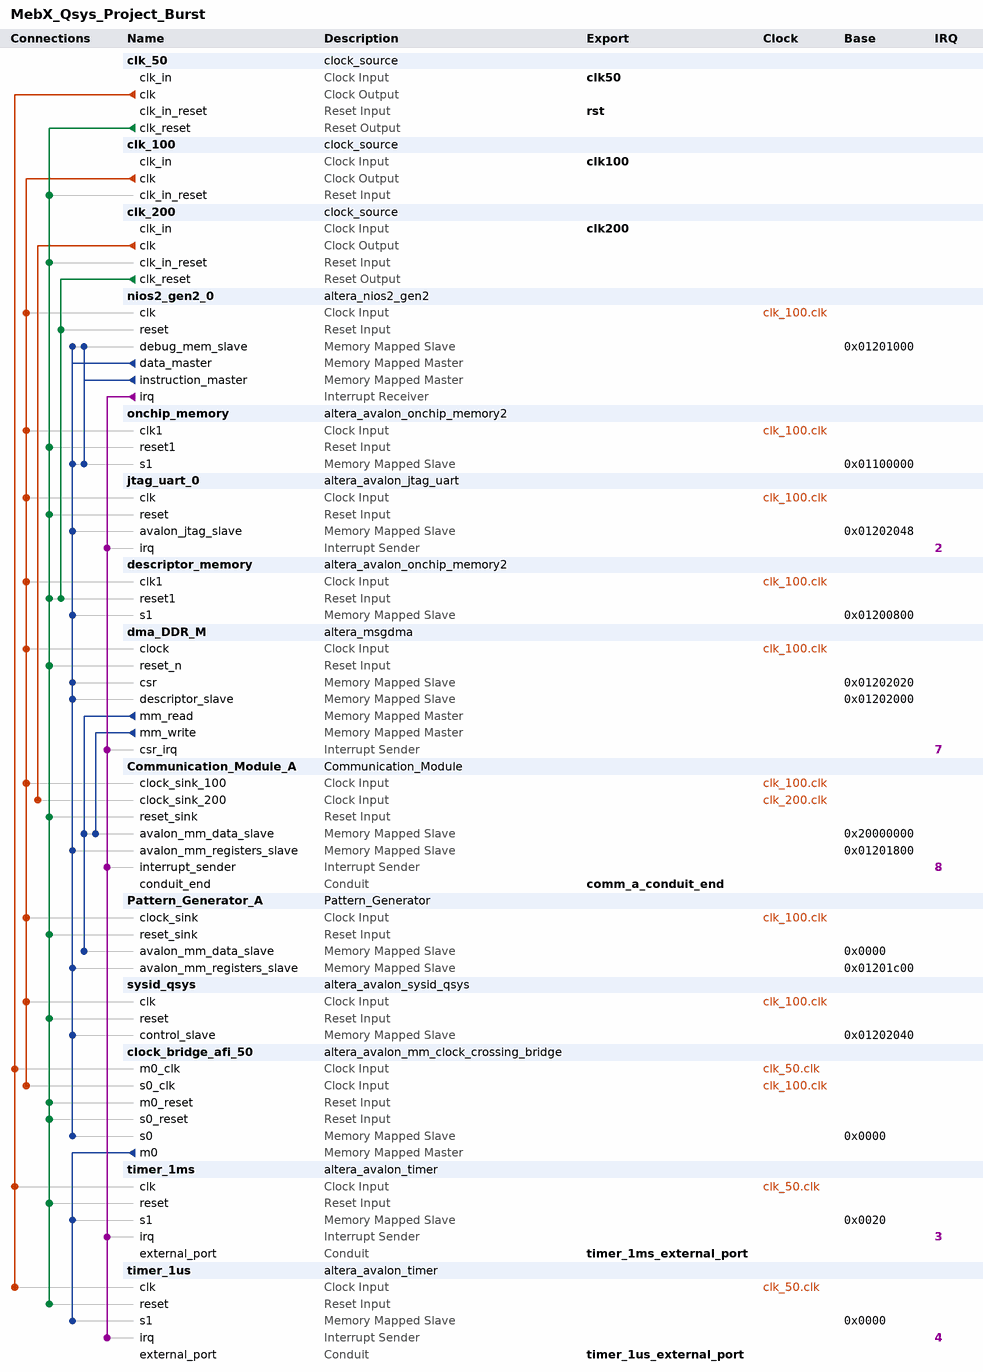
[diagram p0: system contents]
# Platform Designer (Qsys) system MebX_Qsys_Project_Burst, Stratix IV EP4SGX230KF40C2
# Parameters at their usual value, and those the tool derives, are not listed.
package require -exact qsys 16.1
create_system MebX_Qsys_Project_Burst
set_project_property DEVICE_FAMILY {Stratix IV}
set_project_property DEVICE EP4SGX230KF40C2

add_instance clk_50 clock_source 16.1
set_instance_parameter_value clk_50 clockFrequency 50000000

add_instance clk_100 clock_source 16.1
set_instance_parameter_value clk_100 clockFrequency 100000000

add_instance clk_200 clock_source 16.1
set_instance_parameter_value clk_200 clockFrequency 200000000

add_instance nios2_gen2_0 altera_nios2_gen2 16.1
set_instance_parameter_value nios2_gen2_0 dcache_size 0
set_instance_parameter_value nios2_gen2_0 debug_hwbreakpoint 2
set_instance_parameter_value nios2_gen2_0 dividerType srt2
set_instance_parameter_value nios2_gen2_0 exceptionSlave onchip_memory.s1
set_instance_parameter_value nios2_gen2_0 icache_burstType Sequential
set_instance_parameter_value nios2_gen2_0 icache_size 4096
set_instance_parameter_value nios2_gen2_0 impl Fast
set_instance_parameter_value nios2_gen2_0 mul_64_impl 1
set_instance_parameter_value nios2_gen2_0 mul_shift_choice 1
set_instance_parameter_value nios2_gen2_0 resetSlave onchip_memory.s1
set_instance_parameter_value nios2_gen2_0 setting_support31bitdcachebypass false

add_instance onchip_memory altera_avalon_onchip_memory2 16.1
set_instance_parameter_value onchip_memory blockType M9K
set_instance_parameter_value onchip_memory dataWidth 32
set_instance_parameter_value onchip_memory dualPort false
set_instance_parameter_value onchip_memory initMemContent false
set_instance_parameter_value onchip_memory initializationFileName onchip_mem.hex
set_instance_parameter_value onchip_memory memorySize 1024000

add_instance jtag_uart_0 altera_avalon_jtag_uart 16.1
set_instance_parameter_value jtag_uart_0 simInteractiveOptions NO_INTERACTIVE_WINDOWS

add_instance descriptor_memory altera_avalon_onchip_memory2 16.1
set_instance_parameter_value descriptor_memory dataWidth 32
set_instance_parameter_value descriptor_memory dualPort false
set_instance_parameter_value descriptor_memory initMemContent true
set_instance_parameter_value descriptor_memory initializationFileName onchip_mem.hex
set_instance_parameter_value descriptor_memory memorySize 2048

add_instance dma_DDR_M altera_msgdma 16.1
set_instance_parameter_value dma_DDR_M BURST_ENABLE 1
set_instance_parameter_value dma_DDR_M DATA_FIFO_DEPTH 64
set_instance_parameter_value dma_DDR_M DATA_WIDTH 64
set_instance_parameter_value dma_DDR_M DESCRIPTOR_FIFO_DEPTH 32
set_instance_parameter_value dma_DDR_M ENHANCED_FEATURES 1
set_instance_parameter_value dma_DDR_M ERROR_ENABLE 0
set_instance_parameter_value dma_DDR_M FIX_ADDRESS_WIDTH 64
set_instance_parameter_value dma_DDR_M MAX_BURST_COUNT 16
set_instance_parameter_value dma_DDR_M MAX_BYTE 67108864
set_instance_parameter_value dma_DDR_M MODE 0
set_instance_parameter_value dma_DDR_M PACKET_ENABLE 0
set_instance_parameter_value dma_DDR_M TRANSFER_TYPE {Aligned Accesses}
set_instance_parameter_value dma_DDR_M USE_FIX_ADDRESS_WIDTH 1

add_instance Communication_Module_A Communication_Module 1.4

add_instance Pattern_Generator_A Pattern_Generator 1.0

add_instance sysid_qsys altera_avalon_sysid_qsys 16.1
set_instance_parameter_value sysid_qsys id 0

add_instance clock_bridge_afi_50 altera_avalon_mm_clock_crossing_bridge 16.1
set_instance_parameter_value clock_bridge_afi_50 ADDRESS_WIDTH 32
set_instance_parameter_value clock_bridge_afi_50 COMMAND_FIFO_DEPTH 4
set_instance_parameter_value clock_bridge_afi_50 DATA_WIDTH 32
set_instance_parameter_value clock_bridge_afi_50 MASTER_SYNC_DEPTH 2
set_instance_parameter_value clock_bridge_afi_50 MAX_BURST_SIZE 1
set_instance_parameter_value clock_bridge_afi_50 RESPONSE_FIFO_DEPTH 4
set_instance_parameter_value clock_bridge_afi_50 SLAVE_SYNC_DEPTH 2
set_instance_parameter_value clock_bridge_afi_50 USE_AUTO_ADDRESS_WIDTH 1

add_instance timer_1ms altera_avalon_timer 16.1
set_instance_parameter_value timer_1ms alwaysRun true
set_instance_parameter_value timer_1ms period 1
set_instance_parameter_value timer_1ms periodUnits MSEC
set_instance_parameter_value timer_1ms timeoutPulseOutput true

add_instance timer_1us altera_avalon_timer 16.1
set_instance_parameter_value timer_1us alwaysRun true
set_instance_parameter_value timer_1us period 1
set_instance_parameter_value timer_1us periodUnits USEC
set_instance_parameter_value timer_1us timeoutPulseOutput true

# connections
add_connection clk_50.clk clock_bridge_afi_50.m0_clk clock
add_connection clk_50.clk timer_1ms.clk clock
add_connection clk_50.clk timer_1us.clk clock
add_connection clk_100.clk clock_bridge_afi_50.s0_clk clock
add_connection clk_100.clk Communication_Module_A.clock_sink_100 clock
add_connection clk_100.clk descriptor_memory.clk1 clock
add_connection clk_100.clk dma_DDR_M.clock clock
add_connection clk_100.clk jtag_uart_0.clk clock
add_connection clk_100.clk nios2_gen2_0.clk clock
add_connection clk_100.clk onchip_memory.clk1 clock
add_connection clk_100.clk Pattern_Generator_A.clock_sink clock
add_connection clk_100.clk sysid_qsys.clk clock
add_connection clk_200.clk Communication_Module_A.clock_sink_200 clock
add_connection clk_50.clk_reset clk_100.clk_in_reset reset
add_connection clk_50.clk_reset clk_200.clk_in_reset reset
add_connection clk_50.clk_reset clock_bridge_afi_50.m0_reset reset
add_connection clk_50.clk_reset clock_bridge_afi_50.s0_reset reset
add_connection clk_50.clk_reset Communication_Module_A.reset_sink reset
add_connection clk_50.clk_reset descriptor_memory.reset1 reset
add_connection clk_50.clk_reset dma_DDR_M.reset_n reset
add_connection clk_50.clk_reset jtag_uart_0.reset reset
add_connection clk_50.clk_reset onchip_memory.reset1 reset
add_connection clk_50.clk_reset Pattern_Generator_A.reset_sink reset
add_connection clk_50.clk_reset sysid_qsys.reset reset
add_connection clk_50.clk_reset timer_1ms.reset reset
add_connection clk_50.clk_reset timer_1us.reset reset
add_connection clk_200.clk_reset descriptor_memory.reset1 reset
add_connection clk_200.clk_reset nios2_gen2_0.reset reset
add_connection clock_bridge_afi_50.m0 timer_1ms.s1 avalon
set_connection_parameter_value clock_bridge_afi_50.m0/timer_1ms.s1 baseAddress 0x0020
add_connection clock_bridge_afi_50.m0 timer_1us.s1 avalon
set_connection_parameter_value clock_bridge_afi_50.m0/timer_1us.s1 baseAddress 0x0000
add_connection dma_DDR_M.mm_read Communication_Module_A.avalon_mm_data_slave avalon
set_connection_parameter_value dma_DDR_M.mm_read/Communication_Module_A.avalon_mm_data_slave baseAddress 0x20000000
add_connection dma_DDR_M.mm_read Pattern_Generator_A.avalon_mm_data_slave avalon
set_connection_parameter_value dma_DDR_M.mm_read/Pattern_Generator_A.avalon_mm_data_slave baseAddress 0x0000
add_connection dma_DDR_M.mm_write Communication_Module_A.avalon_mm_data_slave avalon
set_connection_parameter_value dma_DDR_M.mm_write/Communication_Module_A.avalon_mm_data_slave baseAddress 0x20000000
add_connection nios2_gen2_0.data_master clock_bridge_afi_50.s0 avalon
set_connection_parameter_value nios2_gen2_0.data_master/clock_bridge_afi_50.s0 baseAddress 0x0000
add_connection nios2_gen2_0.data_master Communication_Module_A.avalon_mm_registers_slave avalon
set_connection_parameter_value nios2_gen2_0.data_master/Communication_Module_A.avalon_mm_registers_slave baseAddress 0x01201800
add_connection nios2_gen2_0.data_master descriptor_memory.s1 avalon
set_connection_parameter_value nios2_gen2_0.data_master/descriptor_memory.s1 baseAddress 0x01200800
add_connection nios2_gen2_0.data_master dma_DDR_M.csr avalon
set_connection_parameter_value nios2_gen2_0.data_master/dma_DDR_M.csr baseAddress 0x01202020
add_connection nios2_gen2_0.data_master dma_DDR_M.descriptor_slave avalon
set_connection_parameter_value nios2_gen2_0.data_master/dma_DDR_M.descriptor_slave baseAddress 0x01202000
add_connection nios2_gen2_0.data_master jtag_uart_0.avalon_jtag_slave avalon
set_connection_parameter_value nios2_gen2_0.data_master/jtag_uart_0.avalon_jtag_slave baseAddress 0x01202048
add_connection nios2_gen2_0.data_master nios2_gen2_0.debug_mem_slave avalon
set_connection_parameter_value nios2_gen2_0.data_master/nios2_gen2_0.debug_mem_slave baseAddress 0x01201000
add_connection nios2_gen2_0.data_master onchip_memory.s1 avalon
set_connection_parameter_value nios2_gen2_0.data_master/onchip_memory.s1 baseAddress 0x01100000
add_connection nios2_gen2_0.data_master Pattern_Generator_A.avalon_mm_registers_slave avalon
set_connection_parameter_value nios2_gen2_0.data_master/Pattern_Generator_A.avalon_mm_registers_slave baseAddress 0x01201c00
add_connection nios2_gen2_0.data_master sysid_qsys.control_slave avalon
set_connection_parameter_value nios2_gen2_0.data_master/sysid_qsys.control_slave baseAddress 0x01202040
add_connection nios2_gen2_0.instruction_master nios2_gen2_0.debug_mem_slave avalon
set_connection_parameter_value nios2_gen2_0.instruction_master/nios2_gen2_0.debug_mem_slave baseAddress 0x01201000
add_connection nios2_gen2_0.instruction_master onchip_memory.s1 avalon
set_connection_parameter_value nios2_gen2_0.instruction_master/onchip_memory.s1 baseAddress 0x01100000
add_connection nios2_gen2_0.irq Communication_Module_A.interrupt_sender interrupt
set_connection_parameter_value nios2_gen2_0.irq/Communication_Module_A.interrupt_sender irqNumber 8
add_connection nios2_gen2_0.irq dma_DDR_M.csr_irq interrupt
set_connection_parameter_value nios2_gen2_0.irq/dma_DDR_M.csr_irq irqNumber 7
add_connection nios2_gen2_0.irq jtag_uart_0.irq interrupt
set_connection_parameter_value nios2_gen2_0.irq/jtag_uart_0.irq irqNumber 2
add_connection nios2_gen2_0.irq timer_1ms.irq interrupt
set_connection_parameter_value nios2_gen2_0.irq/timer_1ms.irq irqNumber 3
add_connection nios2_gen2_0.irq timer_1us.irq interrupt
set_connection_parameter_value nios2_gen2_0.irq/timer_1us.irq irqNumber 4

# exported interfaces
add_interface clk100 clock sink
set_interface_property clk100 EXPORT_OF clk_100.clk_in
add_interface clk200 clock sink
set_interface_property clk200 EXPORT_OF clk_200.clk_in
add_interface clk50 clock sink
set_interface_property clk50 EXPORT_OF clk_50.clk_in
add_interface comm_a_conduit_end conduit end
set_interface_property comm_a_conduit_end EXPORT_OF Communication_Module_A.conduit_end
add_interface rst reset sink
set_interface_property rst EXPORT_OF clk_50.clk_in_reset
add_interface timer_1ms_external_port conduit end
set_interface_property timer_1ms_external_port EXPORT_OF timer_1ms.external_port
add_interface timer_1us_external_port conduit end
set_interface_property timer_1us_external_port EXPORT_OF timer_1us.external_port

set_interconnect_requirement {$system} qsys_mm.clockCrossingAdapter HANDSHAKE
set_interconnect_requirement {$system} qsys_mm.insertDefaultSlave FALSE
set_interconnect_requirement {$system} qsys_mm.maxAdditionalLatency 1

save_system MebX_Qsys_Project_Burst.qsys
